# Altium project Can-Probe.PrjPcb
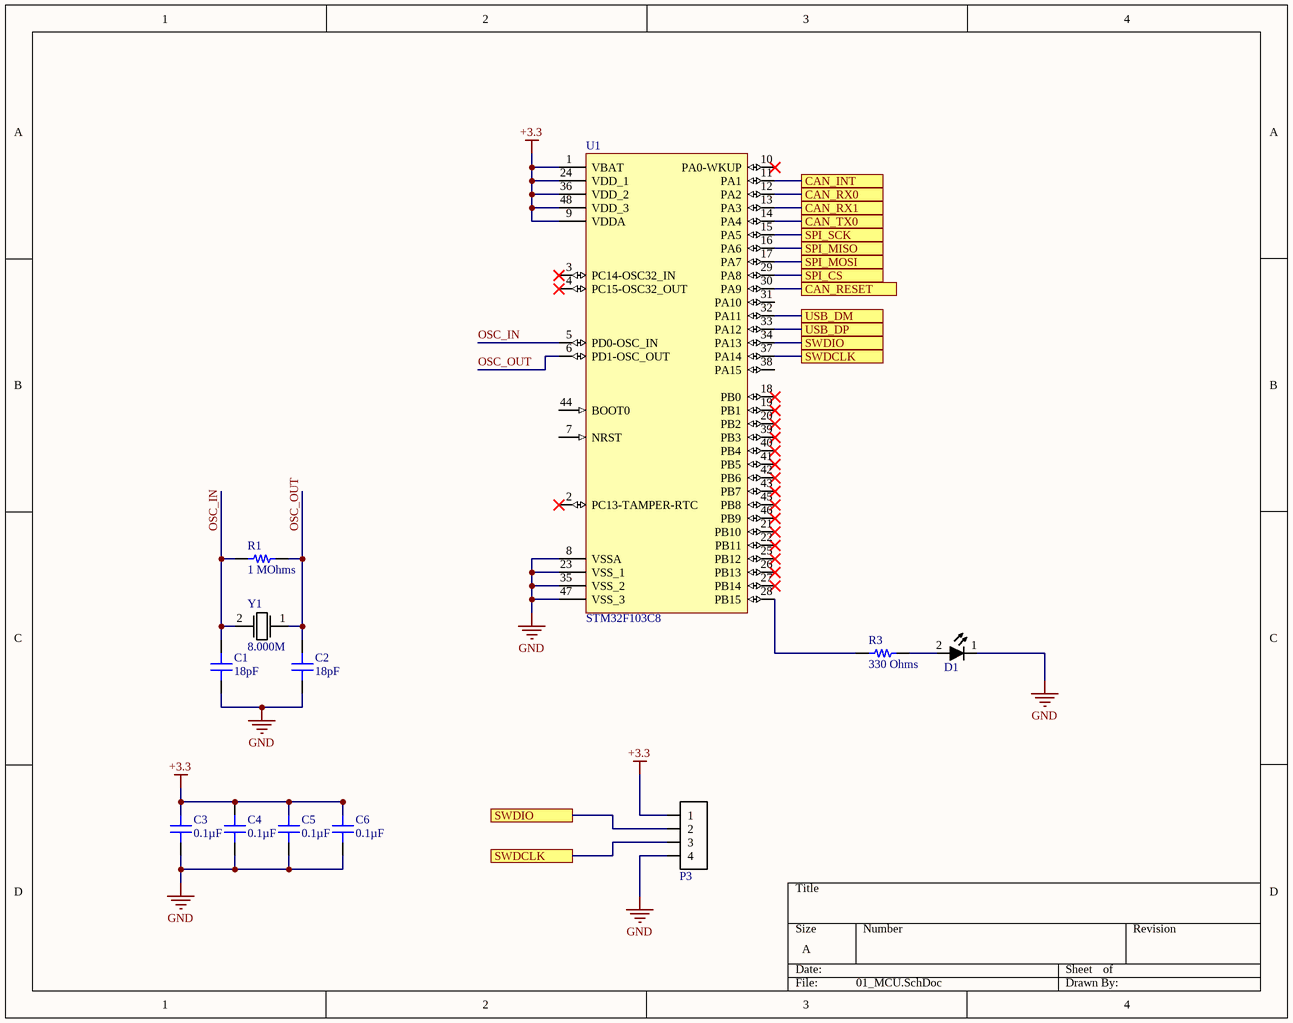
[diagram p0: 01_MCU.SchDoc]
3 sheets, 21 parts. Net scope: flat (ports and power ports of the same name join across sheets).
Board file: Board.PcbDoc
Sheets:
  01_MCU.SchDoc
  02_Power.SchDoc
  03_Periphs.SchDoc

## Sheet 01_MCU.SchDoc
size A; SheetNumber: 1; SheetTotal: 3

### Parts
C1  18pF  [CAP 0603_1608]
C2  18pF  [CAP 0603_1608]
C3  0.1µF  [CAP 0805_2012]
C4  0.1µF  [CAP 0805_2012]
C5  0.1µF  [CAP 0805_2012]
C6  0.1µF  [CAP 0805_2012]
D1  diode_4  [chip_0603_LED]  (value not drawn)
P3  conn-4x1_0  [HDDR_4x1_0]  (value not drawn)
R1  1 MOhms  [RES 0603_1608]
R3  330 Ohms  [RES 0603_1608]
U1  STM32F103C8  [LQFP48_0]
Y1  Frequency: 8.000M  [ABLS_AT49_OSC]  (hidden comment: osc_xtal_2p_0)

### Ports
CAN_INT, CAN_RESET, CAN_RX0, CAN_RX1, CAN_TX0, SPI_CS, SPI_MISO, SPI_MOSI, SPI_SCK, SWDCLK, SWDIO, USB_DM, USB_DP

### Nets
+3.3: C3.2 C4.2 C5.2 C6.2 P3.1 U1.1(VBAT) U1.9(VDDA) U1.24(VDD_1) U1.36(VDD_2) U1.48(VDD_3)
GND: C1.1 C2.1 C3.1 C4.1 C5.1 C6.1 D1.1 P3.4 U1.8(VSSA) U1.23(VSS_1) U1.35(VSS_2) U1.47(VSS_3)
OSC_IN: C1.2 R1.1 U1.5(PD0-OSC_IN) Y1.2
OSC_OUT: C2.2 R1.2 U1.6(PD1-OSC_OUT) Y1.1
NetD1_2: D1.2 R3.2
NetP1_2: U1.32(PA11) ; port USB_DM
NetP1_3: U1.33(PA12) ; port USB_DP
NetP3_2: P3.2 U1.34(PA13) ; port SWDIO
NetP3_3: P3.3 U1.37(PA14) ; port SWDCLK
NetR3_1: R3.1 U1.28(PB15)
NetU1_11: U1.11(PA1) ; port CAN_INT
NetU1_12: U1.12(PA2) ; port CAN_RX0
NetU1_13: U1.13(PA3) ; port CAN_RX1
NetU1_14: U1.14(PA4) ; port CAN_TX0
NetU1_15: U1.15(PA5) ; port SPI_SCK
NetU1_16: U1.16(PA6) ; port SPI_MISO
NetU1_17: U1.17(PA7) ; port SPI_MOSI
NetU1_29: U1.29(PA8) ; port SPI_CS
NetU1_30: U1.30(PA9) ; port CAN_RESET

Not connected (* = marked no-connect by the designer): U1 2(PC13-TAMPER-RTC)* 3(PC14-OSC32_IN)* 4(PC15-OSC32_OUT)* 7(NRST) 10(PA0-WKUP)* 18(PB0)* 19(PB1)* 20(PB2)* 21(PB10)* 22(PB11)* 25(PB12)* 26(PB13)* 27(PB14)* 31(PA10) 38(PA15) 39(PB3)* 40(PB4)* 41(PB5)* 42(PB6)* 43(PB7)* 44(BOOT0) 45(PB8)* 46(PB9)*

### Library data of the parts
C1 C2 = C0603X180J5GACTU: CAP CER 18PF 50V C0G/NP0 0603; Manufacturer: KEMET; Temperature Coefficient: C0G, NP0; Tolerance: ±5%; Part Number: C0603X180J5GACTU; Value: 18pF; Applications: Boardflex Sensitive; Capacitance: 18pF; ComponentLink1Description: Datasheet; ComponentLink1URL: https://api.kemet.com/component-edge/download/specsheet/C0603X180J5GACTU.pdf; ComponentLink2Description: DigiKey Link; ComponentLink2URL: http://digikey.com/product-detail/en/kemet/C0603X180J5GACTU/399-7390-1-ND/3317424; Device Package: 0603 (1608 Metric); Features: Low ESL, Soft Termination; LastUpdated: 9/2/2020 1:03:35 AM; Lifecycle Status: Active; Minimum Order: 1; Mounting Type: Surface Mount, MLCC; Operating Temperature: -55°C ~ 125°C; Package / Case: 0603 (1608 Metric); Packaging: TapeAndReel; PartId: 2471; Part Status: Active; Price: 0.08; Series: SMD Comm C0G Flex; Size / Dimension: 0.063" L x 0.031" W (1.60mm x 0.80mm); Supplier 1: DigiKey; Supplier Part Number 1: 399-7390-1-ND; Thickness (Max): 0.034" (0.87mm); Voltage - Rated: 50V
C3-C6 = C0805X104K5RAC3316: CAP CER 0805 0.1UF 50V X7R; Manufacturer: KEMET; Tolerance: ±10%; Part Number: C0805X104K5RAC3316; Value: 0.1µF; Applications: Automotive, Boardflex Sensitive; Capacitance: 0.1µF; ComponentLink1Description: Datasheet; ComponentLink1URL: https://api.kemet.com/component-edge/download/datasheet/C0805X104K5RAC3316.pdf; ComponentLink2Description: DigiKey Link; ComponentLink2URL: http://digikey.com/product-detail/en/kemet/C0805X104K5RAC3316/399-C0805X104K5RAC3316CT-ND/10315823; Device Package: 0805 (2012 Metric); Features: Soft Termination; LastUpdated: 9/2/2020 1:04:41 AM; Lifecycle Status: Active; Minimum Order: 1; Mounting Type: Surface Mount, MLCC; Operating Temperature: -55°C ~ 125°C; Package / Case: 0805 (2012 Metric); Packaging: TapeAndReel; PartId: 2769; Part Status: Active; Price: 0.08; Ratings: AEC-Q200; Series: SMD Auto X7R VW80808; Size / Dimension: 0.079" L x 0.049" W (2.00mm x 1.25mm); Supplier 1: DigiKey; Supplier Part Number 1: 399-C0805X104K5RAC3316CT-ND; Temperature Coefficient: X7R; Thickness (Max): 0.047" (1.20mm); Voltage - Rated: 50V
D1 = DIO-00049: LED, Blue, 0603, Low current, HELI2 Series; Manufacturer: Kingbright; Manufacturer PN: APT1608LVBC/D; Forward Voltage: 2.65V; Reverse Breakdown Voltage: 5V; Power Rating: 120mW; Current Rating: 30mA; Part Number: DIO-00049; Type: LED; Cost: 0.58
P3 = CONN-00029: Header 4x1, 0.1"; Positions per level: 4; Levels: 1; Part Number: CONN-00029; Type: Header
R1 = RCS06031M00FKEA: RES SMD 1M OHM 1% 1/4W 0603; Manufacturer: Vishay Dale; Power (Watts): 0.25W, 1/4W; Temperature Coefficient: ±100ppm/°C; Part Number: RCS06031M00FKEA; Value: 1 MOhms; ComponentLink1Description: Datasheet; ComponentLink1URL: http://www.vishay.com/docs/20065/rcse3.pdf; ComponentLink2Description: DigiKey Link; ComponentLink2URL: http://digikey.com/product-detail/en/vishay-dale/RCS06031M00FKEA/541-2803-1-ND/5867096; Composition: Thick Film; Device Package: 0603 (1608 Metric); Features: Automotive AEC-Q200, Pulse Withstanding; Height - Seated (Max): 0.020" (0.50mm); LastUpdated: 9/2/2020 1:09:49 AM; Lifecycle Status: Active; Minimum Order: 1; Number of Terminations: 2; Operating Temperature: -55°C ~ 155°C; Package / Case: 0603 (1608 Metric); Packaging: TapeAndReel; PartId: 21301; Part Status: Active; Price: 0.02; Ratings: AEC-Q200; Resistance: 1 MOhms; Series: RCS e3; Size / Dimension: 0.061" L x 0.033" W (1.55mm x 0.85mm); Supplier 1: DigiKey; Supplier Part Number 1: 541-2803-1-ND; Supplier Device Package: 0603; Tolerance: ±1%
R3 = RK73B1JTTD331J: RES 330 OHM 5% 1/8W 0603; Manufacturer: KOA Speer Electronics, Inc.; Power (Watts): 0.125W, 1/8W; Temperature Coefficient: ±200ppm/°C; Part Number: RK73B1JTTD331J; Value: 330 Ohms; ComponentLink1Description: Datasheet; ComponentLink1URL: http://www.koaspeer.com/catimages/Products/RK73B/RK73B.pdf; ComponentLink2Description: DigiKey Link; ComponentLink2URL: http://digikey.com/product-detail/en/koa-speer-electronics-inc/RK73B1JTTD331J/2019-RK73B1JTTD331JCT-ND/9846751; Composition: Thick Film; Device Package: 0603 (1608 Metric); Features: Automotive AEC-Q200, Moisture Resistant; Height - Seated (Max): 0.022" (0.55mm); LastUpdated: 9/2/2020 1:10:22 AM; Lifecycle Status: Active; Minimum Order: 1; Number of Terminations: 2; Operating Temperature: -55°C ~ 155°C; Package / Case: 0603 (1608 Metric); Packaging: CutTape; PartId: 5985; Part Status: Active; Price: 0.10; Ratings: AEC-Q200; Resistance: 330 Ohms; Series: RK73B; Size / Dimension: 0.063" L x 0.031" W (1.60mm x 0.80mm); Supplier 1: DigiKey; Supplier Part Number 1: 2019-RK73B1JTTD331JCT-ND; Supplier Device Package: 0603; Tolerance: ±5%
U1 = UCTRL-00008: STM32 M3, LQFP-48; Manufacturer: ST; Part Number: UCTRL-00008; Manufacturer PN: STM32F103C8
Y1 = OSC-00002: XTAL, 8MHz, 18pF, 20ppm; Manufacturer: Abracon; Manufacturer PN: ABLS-8.000MHZ-B2-T; ESR: 80; Stability: 50ppm; Load Capacitance: 18pF; Tolerance: 20ppm; Part Number: OSC-00002

## Sheet 02_Power.SchDoc
size A; SheetNumber: 2; SheetTotal: 3
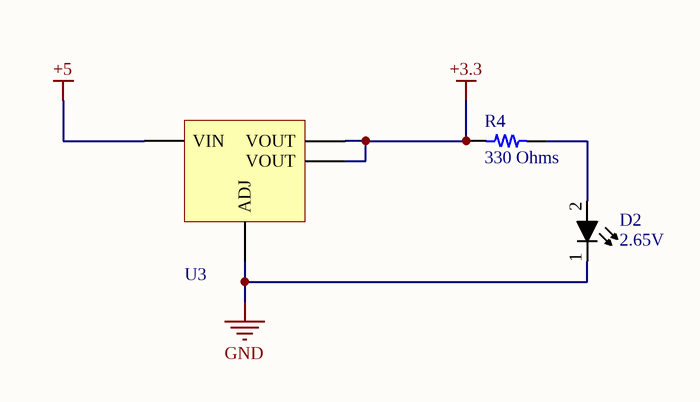
[diagram p1: 02_Power.SchDoc]

### Parts
D2  Forward Voltage: 2.65V  [chip_0603_LED]  (hidden comment: diode_4)
R4  330 Ohms  [RES 0603_1608]
U3  LM1117  [sot-223-4]  (value not drawn)

### Nets
+3.3: R4.1 U3.2(VOUT) U3.4(VOUT)
+5: U3.3(VIN)
GND: D2.1 U3.1(ADJ)
NetD2_2: D2.2 R4.2

### Library data of the parts
D2 = DIO-00050: LED, Green, 0603, Low current, HELI2 Series; Manufacturer: Kingbright; Manufacturer PN: APT1608LZGCK; Reverse Breakdown Voltage: 5V; Current Rating: 30mA; Power Rating: 120mW; Type: LED; Part Number: DIO-00050; Cost: 0.58
R4 = RK73B1JTTD331J: as R3 on sheet 01_MCU; Part Number: RK73B1JTTD331J; Value: 330 Ohms; ComponentLink1Description: Datasheet; ComponentLink1URL: http://www.koaspeer.com/catimages/Products/RK73B/RK73B.pdf; ComponentLink2Description: DigiKey Link; ComponentLink2URL: http://digikey.com/product-detail/en/koa-speer-electronics-inc/RK73B1JTTD331J/2019-RK73B1JTTD331JCT-ND/9846751; Composition: Thick Film; Device Package: 0603 (1608 Metric); Features: Automotive AEC-Q200, Moisture Resistant; Height - Seated (Max): 0.022" (0.55mm); LastUpdated: 9/2/2020 1:10:22 AM; Lifecycle Status: Active; Minimum Order: 1; Number of Terminations: 2; Operating Temperature: -55°C ~ 155°C; Package / Case: 0603 (1608 Metric); Packaging: CutTape; PartId: 5985; Part Status: Active; Price: 0.10; Ratings: AEC-Q200; Resistance: 330 Ohms; Series: RK73B; Size / Dimension: 0.063" L x 0.031" W (1.60mm x 0.80mm); Supplier 1: DigiKey; Supplier Part Number 1: 2019-RK73B1JTTD331JCT-ND; Supplier Device Package: 0603; Tolerance: ±5%
U3 = PWREG-00018: REG, Linear, Fixed 3V3, 800mA, SOT-223; Manufacturer: TI; Manufacturer PN: LM1117MPX-3.3/NOPB; Voltage Range In: 4.5 - 15V; Voltage Range Out: 3.3V; Part Number: PWREG-00018; Max Current: 800mA; Reg Type: Linear; Fixed/Adj: Fixed; Cost: 1.14

## Sheet 03_Periphs.SchDoc
size A; SheetNumber: 3; SheetTotal: 3
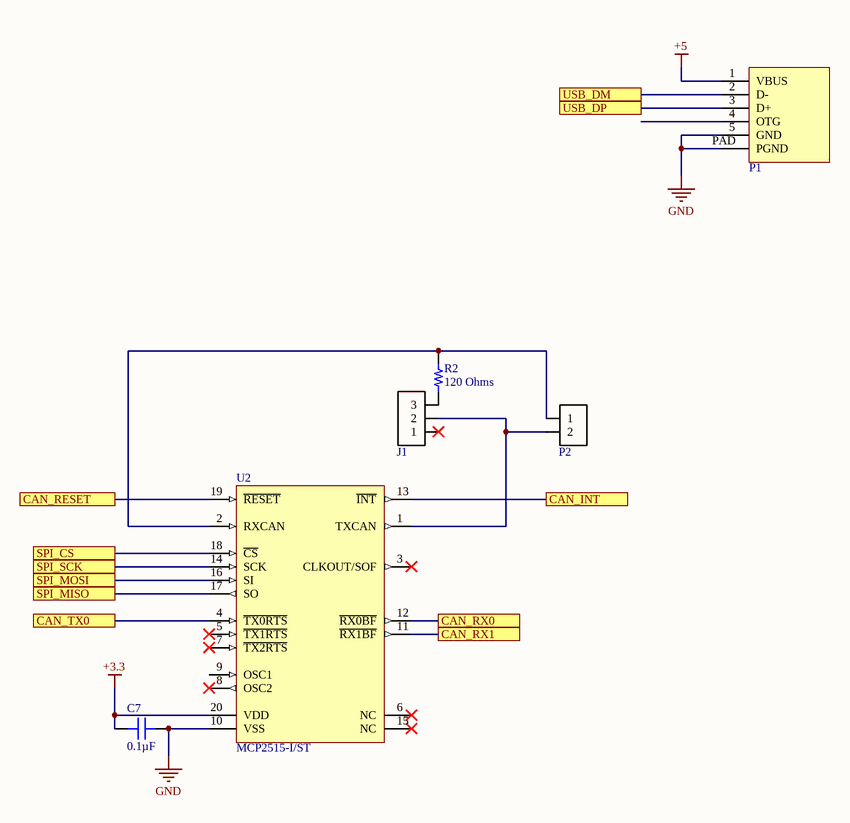
[diagram p2: 03_Periphs.SchDoc]

### Parts
C7  0.1µF  [CAP 0805_2012]
J1  conn-3x1_0  [HDDR_3x1_0]  (value not drawn)
P1  usb_micro_b  [10118192]  (value not drawn)
P2  conn-2x1_0  [TERM_3.50MM_2x1_0]  (value not drawn)
R2  120 Ohms  [RES 0805_2012]
U2  MCP2515-I/ST  [TSSOP-ST20_N]

### Ports
CAN_INT, CAN_RESET, CAN_RX0, CAN_RX1, CAN_TX0, SPI_CS, SPI_MISO, SPI_MOSI, SPI_SCK, USB_DM, USB_DP

### Nets
+3.3: C7.2 U2.20(VDD)
+5: P1.1(VBUS)
GND: C7.1 P1.5(GND) P1.PAD(PGND) U2.10(VSS)
NetJ1_2: J1.2 P2.2 U2.1(TXCAN)
NetJ1_3: J1.3 R2.1
NetP1_2: P1.2(D-) ; port USB_DM
NetP1_3: P1.3(D+) ; port USB_DP
NetP2_1: P2.1 R2.2 U2.2(RXCAN)
NetU1_11: U2.13(~{INT}) ; port CAN_INT
NetU1_12: U2.12(~{RX0BF}) ; port CAN_RX0
NetU1_13: U2.11(~{RX1BF}) ; port CAN_RX1
NetU1_14: U2.4(~{TX0RTS}) ; port CAN_TX0
NetU1_15: U2.14(SCK) ; port SPI_SCK
NetU1_16: U2.17(SO) ; port SPI_MISO
NetU1_17: U2.16(SI) ; port SPI_MOSI
NetU1_29: U2.18(~{CS}) ; port SPI_CS
NetU1_30: U2.19(~{RESET}) ; port CAN_RESET

Not connected (* = marked no-connect by the designer): J1 1*; P1 4(OTG); U2 3(CLKOUT/SOF)* 5(~{TX1RTS})* 6(NC)* 7(~{TX2RTS})* 8(OSC2)* 9(OSC1) 15(NC)*

### Library data of the parts
C7 = C0805X104K5RAC3316: as C3 on sheet 01_MCU; Part Number: C0805X104K5RAC3316; Value: 0.1µF; Applications: Automotive, Boardflex Sensitive; Capacitance: 0.1µF; ComponentLink1Description: Datasheet; ComponentLink1URL: https://api.kemet.com/component-edge/download/datasheet/C0805X104K5RAC3316.pdf; ComponentLink2Description: DigiKey Link; ComponentLink2URL: http://digikey.com/product-detail/en/kemet/C0805X104K5RAC3316/399-C0805X104K5RAC3316CT-ND/10315823; Device Package: 0805 (2012 Metric); Features: Soft Termination; LastUpdated: 9/2/2020 1:04:41 AM; Lifecycle Status: Active; Minimum Order: 1; Mounting Type: Surface Mount, MLCC; Operating Temperature: -55°C ~ 125°C; Package / Case: 0805 (2012 Metric); Packaging: TapeAndReel; PartId: 2769; Part Status: Active; Price: 0.08; Ratings: AEC-Q200; Series: SMD Auto X7R VW80808; Size / Dimension: 0.079" L x 0.049" W (2.00mm x 1.25mm); Supplier 1: DigiKey; Supplier Part Number 1: 399-C0805X104K5RAC3316CT-ND; Temperature Coefficient: X7R; Thickness (Max): 0.047" (1.20mm); Voltage - Rated: 50V
J1 = CONN-00037: Header, 3x1, 0.1"; Positions per level: 3; Levels: 1; Part Number: CONN-00037; Type: Header
P1 = CONN-00011: USB Micro B Type Receptacle; Manufacturer: Amphenol; Positions per level: 5; Levels: 1; Current: 1.8; Part Number: CONN-00011; Type: USB Micro B; Manufacturer PN: 10118192
P2 = CONN-00023: Term Blk, 2 Pos, 8A, 3.5mm Pitch, Screwless; Manufacturer: Phoenix Contact; Manufacturer PN: 1861933; Positions per level: 2; Levels: 1; Current: 8; Part Number: CONN-00023; Type: Terminal Block; Cost: 0.79; Weight: 1.13
R2 = CRGCQ0805F120R: CRGCQ 0805 120R 1%; Manufacturer: TE Connectivity Passive Product; Power (Watts): 0.125W, 1/8W; Temperature Coefficient: ±100ppm/°C; Part Number: CRGCQ0805F120R; Value: 120 Ohms; ComponentLink1Description: Datasheet; ComponentLink1URL: https://www.te.com/commerce/DocumentDelivery/DDEController?Action=srchrtrv&DocNm=1773204-3&DocType=DS&DocLang=English; ComponentLink2Description: DigiKey Link; ComponentLink2URL: http://digikey.com/product-detail/en/te-connectivity-passive-product/CRGCQ0805F120R/A129738CT-ND/8577570; Composition: Thick Film; Device Package: 0805 (2012 Metric); Features: Automotive AEC-Q200, Moisture Resistant; Height - Seated (Max): 0.026" (0.65mm); LastUpdated: 9/2/2020 1:14:36 AM; Lifecycle Status: Active; Minimum Order: 1; Number of Terminations: 2; Operating Temperature: -55°C ~ 155°C; Package / Case: 0805 (2012 Metric); Packaging: TapeAndReel; PartId: 47663; Part Status: Active; Price: 0.01; Ratings: AEC-Q200; Resistance: 120 Ohms; Series: CRGCQ; Size / Dimension: 0.079" L x 0.049" W (2.00mm x 1.25mm); Supplier 1: DigiKey; Supplier Part Number 1: A129738CT-ND; Supplier Device Package: 0805; Tolerance: ±1%
U2 = CMP-0186-00077-2: Stand-Alone CAN Controller With SPI Interface, 20-Pin TSSOP, Industrial Temperature; DatasheetVersion: revF, Oct-2010; ComponentLink1Description: Manufacturer URL; PackageDescription: 20-Lead Plastic Thin Shrink Small Outline (ST) - 4.4mm Body [TSSOP]; ComponentLink1URL: http://www.microchip.com/; RevisionNote: URLs added. DatasheetVersion updated.; PackageReference: TSSOP-ST20; Code_JEDEC: MO-153-AC; ComponentLink2Description: Datasheet; ComponentLink2URL: http://ww1.microchip.com/downloads/en/DeviceDoc/21801f.pdf; PackageVersion: revBB, Aug-2009; ComponentLink3URL: http://www.microchip.com/stellent/groups/techpub_sg/documents/packagingspec/en012702.pdf; ComponentLink3Description: Package Specification

## Nets that join several sheets
+3.3: 01_MCU (10 pins), 02_Power (R4.1 U3.2 U3.4), 03_Periphs (C7.2 U2.20)
+5: 02_Power (U3.3), 03_Periphs (P1.1)
GND: 01_MCU (12 pins), 02_Power (D2.1 U3.1), 03_Periphs (C7.1 P1.5 P1.PAD U2.10)
NetP1_2: 01_MCU (U1.32), 03_Periphs (P1.2)
NetP1_3: 01_MCU (U1.33), 03_Periphs (P1.3)
NetU1_11: 01_MCU (U1.11), 03_Periphs (U2.13)
NetU1_12: 01_MCU (U1.12), 03_Periphs (U2.12)
NetU1_13: 01_MCU (U1.13), 03_Periphs (U2.11)
NetU1_14: 01_MCU (U1.14), 03_Periphs (U2.4)
NetU1_15: 01_MCU (U1.15), 03_Periphs (U2.14)
NetU1_16: 01_MCU (U1.16), 03_Periphs (U2.17)
NetU1_17: 01_MCU (U1.17), 03_Periphs (U2.16)
NetU1_29: 01_MCU (U1.29), 03_Periphs (U2.18)
NetU1_30: 01_MCU (U1.30), 03_Periphs (U2.19)